# Altium schematic sheet batterij_charging.SchDoc
size A4; SheetNumber: 4; SheetTotal: 13
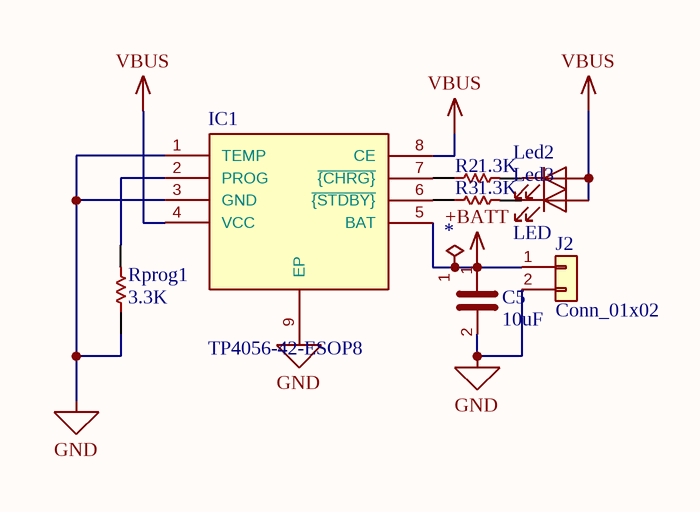
[diagram p0: batterij_charging.SchDoc]

## Parts
*  PWR_FLAG  (value not drawn)  (graphical)
C5  10uF  [CAPC2013X70X45NL10T25]
IC1  TP4056-42-ESOP8  [tp4056]
J2  Conn_01x02  [connector 2pin]
Led2  LED  [LEDC2012X70N]  (value not drawn)
Led3  LED  [LEDC2012X70N]
R2  1.3K  [RESC2013X70X40NL20T20]
R3  1.3K  [RESC2013X70X40NL20T20]
Rprog1  3.3K  [RESC2013X70X40NL20T20]

## Nets
+BATT: *.1(pwr) C5.1 IC1.5(BAT) J2.1(Pin_1)
GND: C5.2 IC1.1(TEMP) IC1.3(GND) IC1.9(EP) J2.2(Pin_2) Rprog1.1
VBUS: IC1.4(VCC) IC1.8(CE) Led2.A Led3.A
NetIC1_2: IC1.2(PROG) Rprog1.2
NetIC1_6: IC1.6(~{{STDBY}}) R3.1
NetIC1_7: IC1.7(~{{CHRG}}) R2.1
NetLed2_C: Led2.C R2.2
NetLed3_C: Led3.C R3.2

## Library data of the parts
C5 = C
R2 R3 Rprog1 = CMP-2100-03671-1: Chip Resistor, 1 KOhm, +/- 1%, 125 mW, -55 to 155 degC, 0805 (2012 Metric), RoHS, Tape and Reel; Manufacturer: Yageo; Temperature Coefficient: 100ppm/degreesC; Voltage Rating (DC): 150V; Max Power Dissipation: 125mW; Resistance: 1KOhm; Number of Pins: 2; Number of Terminations: 2; Datasheet URL: http://www.yageo.com/NewPortal/yageodocoutput?fileName=/pdf/R-Chip/PYu-RC_Group_51_RoHS_L_5.pdf; Length: 0.079inch; Package Description: 2-Pin Surface Mounted Device, Body 2 x 1.25 mm; Depth: 1.25mm; Height: 0.024inch; Military Standard: Not; Case/Package: 0805; Package Reference: 0805; RoHSCompliant: true; Lead Free: LeadFree; Packaging: TapeandReel; Package Quantity: 1; Datasheet Version: Rev. 5, 10/2016; Tolerance: 1%; Min Operating Temperature: -55degC; Voltage Rating: 150V; Composition: ThickFilm; Case Code (Imperial): 0805; Power Rating: 125mW; Width: 0.049inch; Case Code (Metric): 2012; Manufacturer URL: http://www.yageo.com/; Max Operating Temperature: 155degC; REACH SVHC: Unknown; Termination: SMD/SMT